# EAGLE design Akıllı_Lamba (EAGLE 9.6.2)
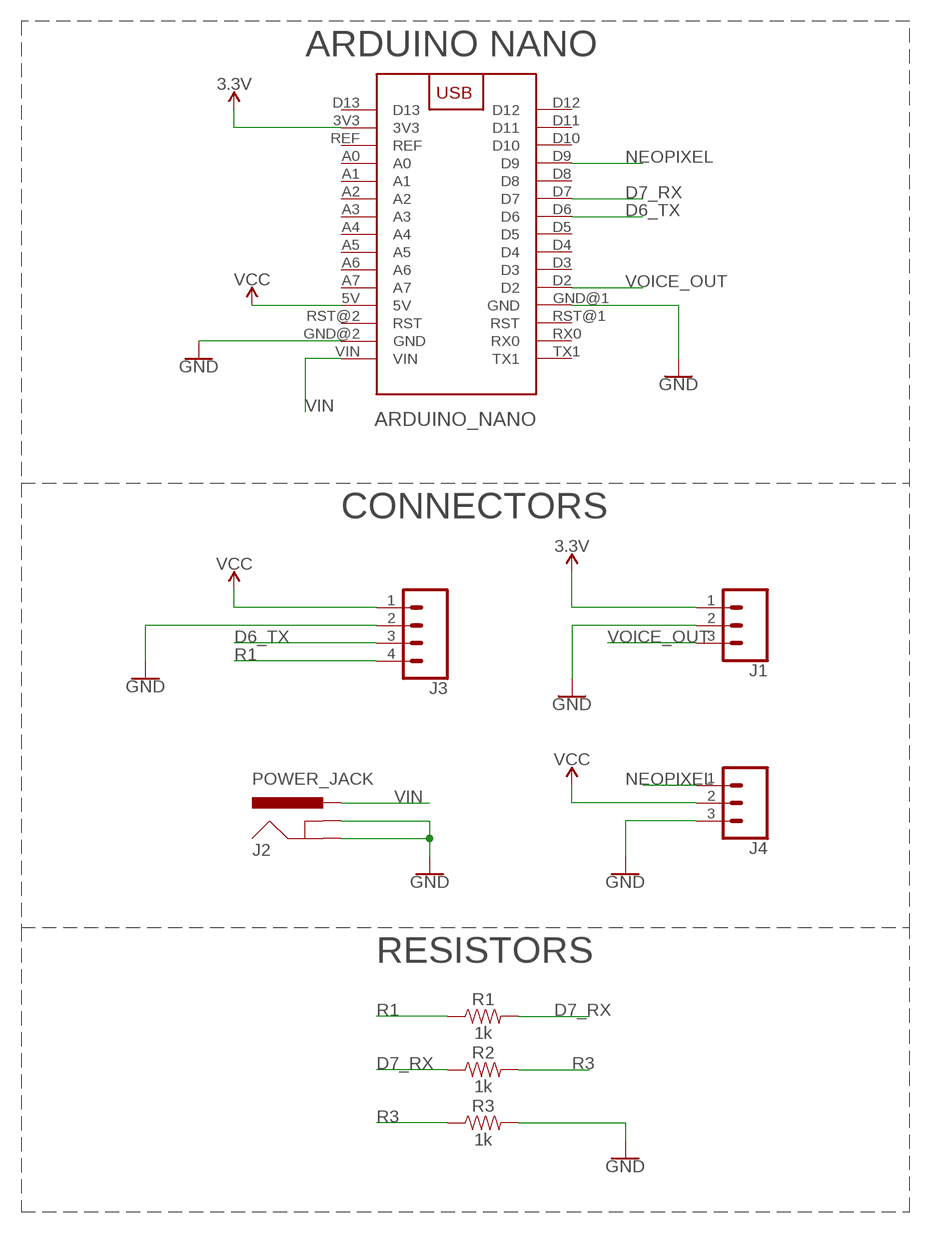
[diagram p0: schematic, sheet 1]

## Parts
ARDUINO_NANO  ARDUINONANO  [ARDUINONANO]
J1  455-1750-1-ND  CONN_03  [1X03]
J2  POWER_JACK  [POWER_JACK_PTH]
J3  CONN_04PTH  [1X04]
J4  455-1750-1-ND  CONN_03  [1X03]
R1  1k  1KOHM-HORIZ-1/4W-5%  [AXIAL-0.3]
R2  1k  1KOHM-HORIZ-1/4W-5%  [AXIAL-0.3]
R3  1k  1KOHM-HORIZ-1/4W-5%  [AXIAL-0.3]

## Nets
3.3V: ARDUINO_NANO.3V3 J1.1
D6_TX: ARDUINO_NANO.D6 J3.3
D7_RX: ARDUINO_NANO.D7 R1.P$2 R2.P$1
GND: ARDUINO_NANO.GND@1(GND) ARDUINO_NANO.GND@2(GND) J1.2 J2.GND J2.GNDBREAK J3.2 J4.3 R3.P$2
NEOPIXEL: ARDUINO_NANO.D9 J4.1
R1: J3.4 R1.P$1
R3: R2.P$2 R3.P$1
VCC: ARDUINO_NANO.5V J3.1 J4.2
VIN: ARDUINO_NANO.VIN J2.PWR
VOICE_OUT: ARDUINO_NANO.D2 J1.3
Unconnected: ARDUINO_NANO.A0 ARDUINO_NANO.A1 ARDUINO_NANO.A2 ARDUINO_NANO.A3 ARDUINO_NANO.A4 ARDUINO_NANO.A5 ARDUINO_NANO.A6 ARDUINO_NANO.A7 ARDUINO_NANO.D3 ARDUINO_NANO.D4 ARDUINO_NANO.D5 ARDUINO_NANO.D8 ARDUINO_NANO.D10 ARDUINO_NANO.D11 ARDUINO_NANO.D12 ARDUINO_NANO.D13 ARDUINO_NANO.REF ARDUINO_NANO.RST@1(RST) ARDUINO_NANO.RST@2(RST) ARDUINO_NANO.RX0 ARDUINO_NANO.TX1

## Notes on the sheet
- ARDUINO NANO
- CONNECTORS
- RESISTORS

## Library data of the parts
ARDUINO_NANO = ARDUINONANOSYMBOL:ARDUINONANO: ARDUINO NANO device
J1 J4 = SparkFun-Connectors:CONN_03: Multi connection point. Often used as Generic Header-pin footprint for 0.1 inch spaced/style header connections On any of the 0.1 inch spaced packages, you can populate with these: Break Away Headers - Straight <https://www.sparkfun.com/products/116> (PRT-00116) Break Away Male Headers - Right Angle <https://www.sparkfun.com/products/553> (PRT-00553) Female Headers <https://www.sparkfun.com/products/115> (PRT-00115) Break Away Headers - Machine Pin <https://www.sparkfun.com/products/117> (PRT-00117) Break Away Female Headers - Swiss Machine Pin <https://www.sparkfun.com/products/743> (PRT-00743) Stackable Header - 3 Pin (Female, 0.1") <https://www.sparkfun.com/products/13875> (PRT-13875) For SCREWTERMINALS and SPRING TERMINALS visit here: Screw Terimnals on SparkFun.com <https://www.sparkfun.com/search/results?term=Screw+Terminals> (5mm/3.5mm/2.54mm spacing) This device is also useful as a general connection point to wire up your design to another part of your project. Our various solder wires solder well into these plated through hole pads. Hook-Up Wire - Assortment (Stranded, 22 AWG) <https://www.sparkfun.com/products/11375> (PRT-11375) Hook-Up Wire - Assortment (Solid Core, 22 AWG) <https://www.sparkfun.com/products/11367> (PRT-11367) View the entire wire category on our website here <https://www.sparkfun.com/categories/141> Special notes: Molex polarized connector foot print use with SKU : PRT-08232 with associated crimp pins and housings.; PROD_ID: XXX-00000
J2 = SparkFun-Connectors:POWER_JACK: Power Jack Connector This is the standard 5.5mm barrel jack for power. The PTH is the most common, proven, reliable, footprint. The Slot footprint only works if the mill layer is transmitted to the PCB fab house so be warned. Here are the connectors we sell at SparkFun: DC Barrel Power Jack/Connector <https://www.sparkfun.com/products/119> (PRT-00119) DC Barrel Power Jack/Connector (SMD) <https://www.sparkfun.com/products/12748> (PRT-12748) DC Barrel Jack Adapter - Breadboard Compatible <https://www.sparkfun.com/products/10811> (PRT-10811) It is used on this SparkFun product (and many, many others): SparkFun RedBoard - Programmed with Arduino <https://www.sparkfun.com/products/12757> (DEV-12757) Also, if you need a mating power supply or connector, please check these out: Wall Adapter Power Supply - 9VDC 650mA <https://www.sparkfun.com/products/298> (TOL-00298) DC Barrel Jack Adapter - Male <https://www.sparkfun.com/products/10287> (PRT-10287); PROD_ID: CONN-08197
J3 = SparkFun-Connectors:CONN_04: Multi connection point. Often used as Generic Header-pin footprint for 0.1 inch spaced/style header connections On any of the 0.1 inch spaced packages, you can populate with these: Break Away Headers - Straight <https://www.sparkfun.com/products/116> (PRT-00116) Break Away Male Headers - Right Angle <https://www.sparkfun.com/products/553> (PRT-00553) Female Headers <https://www.sparkfun.com/products/115> (PRT-00115) Break Away Headers - Machine Pin <https://www.sparkfun.com/products/117> (PRT-00117) Break Away Female Headers - Swiss Machine Pin <https://www.sparkfun.com/products/743> (PRT-00743) For SCREWTERMINALS and SPRING TERMINALS visit here: Screw Terimnals on SparkFun.com <https://www.sparkfun.com/search/results?term=Screw+Terminals> (5mm/3.5mm/2.54mm spacing) This device is also useful as a general connection point to wire up your design to another part of your project. Our various solder wires solder well into these plated through hole pads. Hook-Up Wire - Assortment (Stranded, 22 AWG) <https://www.sparkfun.com/products/11375> (PRT-11375) Hook-Up Wire - Assortment (Solid Core, 22 AWG) <https://www.sparkfun.com/products/11367> (PRT-11367) View the entire wire category on our website here <https://www.sparkfun.com/categories/141> Special notes: Molex polarized connector foot print use with SKU : PRT-08231 with associated crimp pins and housings. 1MM SMD Version SKU: PRT-10208; PROD_ID: CONN-09696
R1-R3 = SparkFun-Resistors:1KOHM: 1kΩ resistor A resistor is a passive two-terminal electrical component that implements electrical resistance as a circuit element. Resistors act to reduce current flow, and, at the same time, act to lower voltage levels within circuits. - Wikipedia; PROD_ID: RES-08380

## Board
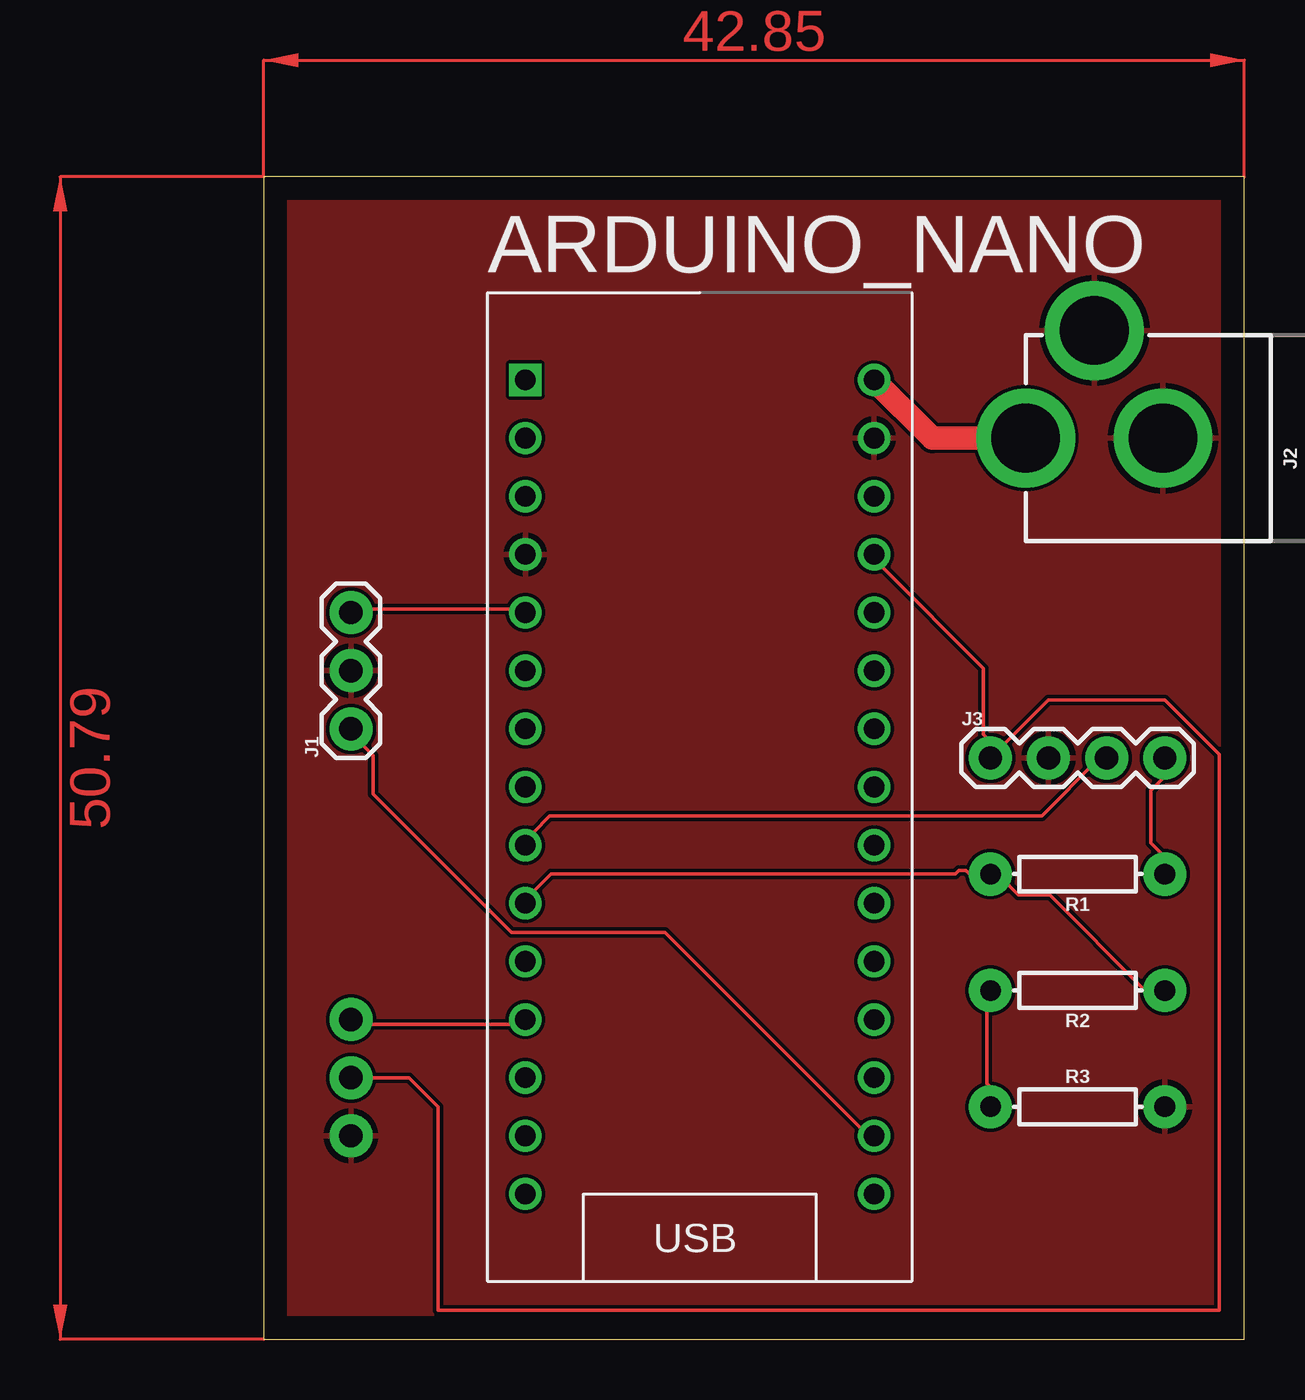
[diagram p1: board, top side]
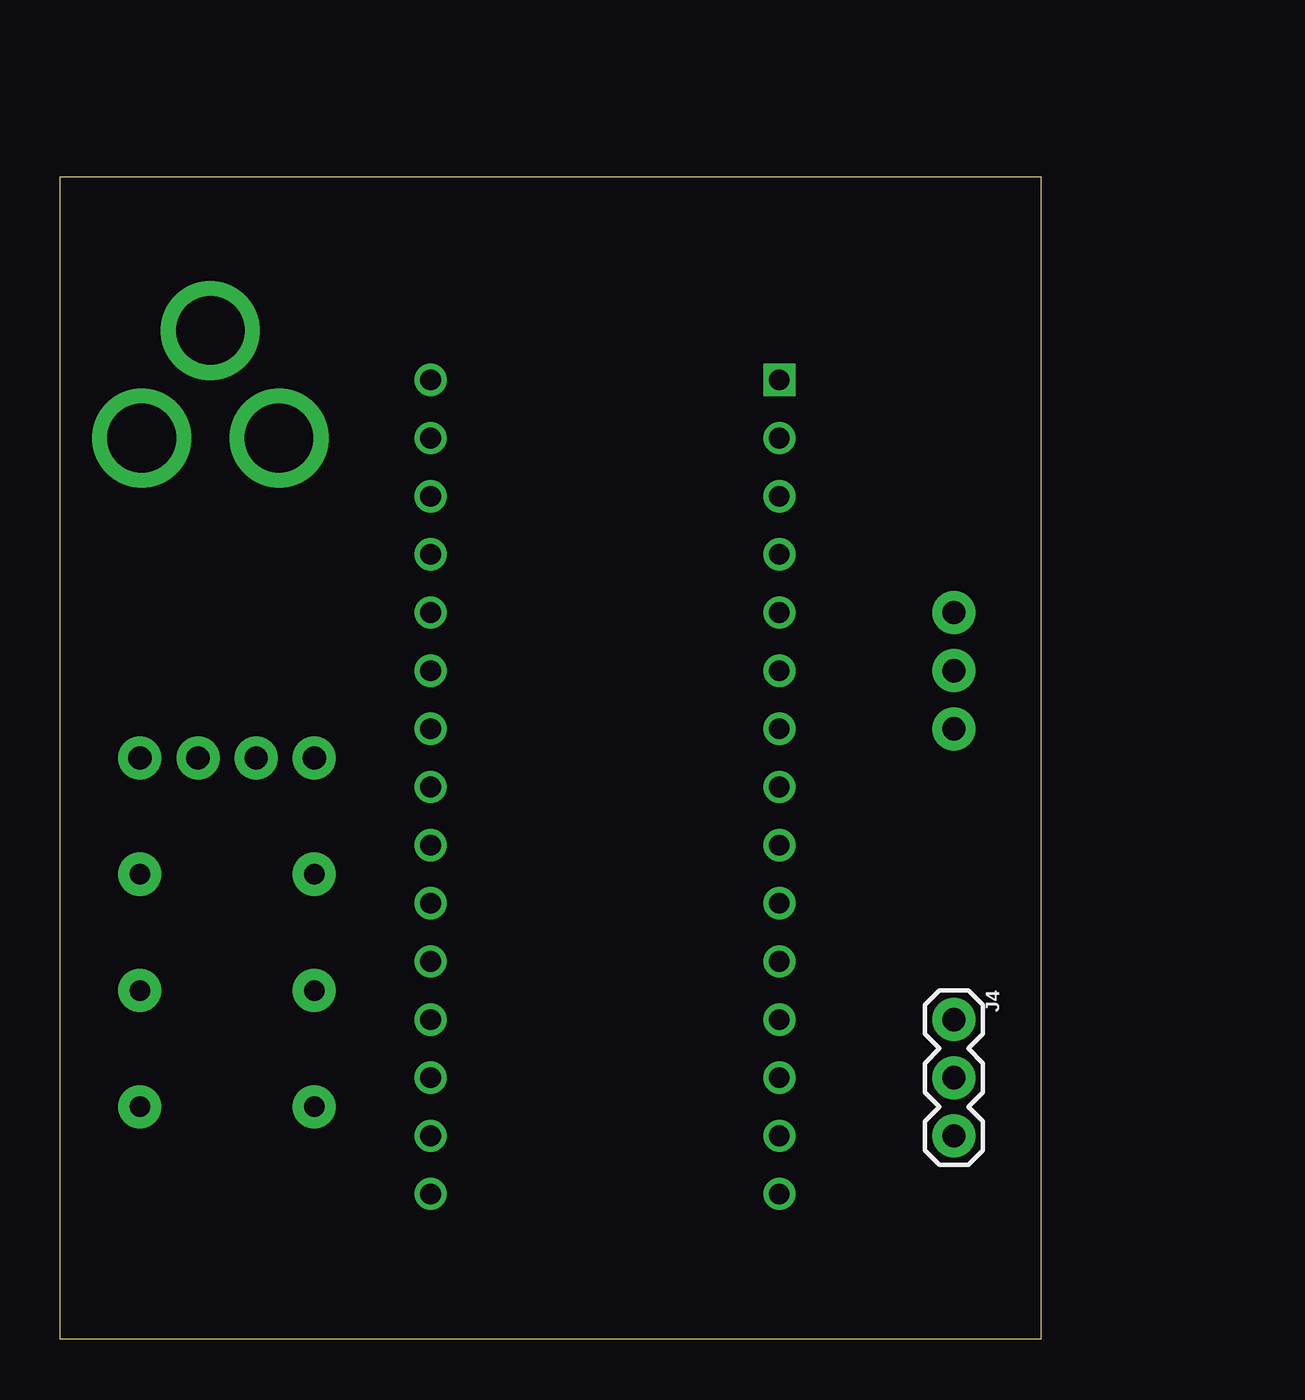
[diagram p2: board, bottom side, seen from below]

Size 42.85 x 50.79 mm. Coordinates in mm from the lower left corner, seen from the top.
Outline: 0,0 42.85,0 42.85,50.79 0,50.79 0,0
Copper layers (1*16): Top 0.035mm / dielectric 1.5mm / Bottom 0.035mm
Design rules "default": minimum track width 6mil, minimum drill 0.35mm, track to track 6mil, track to pad 6mil, pad to pad 6mil, via to via 6mil, smd to smd 6mil, copper to edge 40mil, drill to drill 6mil, minimum pad ring 10mil, minimum via ring 8mil, stop-mask expansion 4mil, vias tented up to drill 0mil, thermal gap 10mil

### Footprints (pad centres in the part's own frame; a part is rotated, then mirrored left to right if it is on the bottom)
ARDUINONANO = drill 0.9: 3V3 7.62,-15.24; 5V 7.62,10.16; A0 7.62,-10.16; A1 7.62,-7.62; A2 7.62,-5.08; A3 7.62,-2.54; A4 7.62,0; A5 7.62,2.54; A6 7.62,5.08; A7 7.62,7.62; D2 -7.62,7.62; D3 -7.62,5.08; D4 -7.62,2.54; D5 -7.62,0; D6 -7.62,-2.54; D7 -7.62,-5.08; D8 -7.62,-7.62; D9 -7.62,-10.16; D10 -7.62,-12.7; D11 -7.62,-15.24; D12 -7.62,-17.78; D13 7.62,-17.78; GND@1 -7.62,10.16; GND@2 7.62,15.24; REF 7.62,-12.7; RST@1 -7.62,12.7; RST@2 7.62,12.7; RX0 -7.62,15.24; VIN 7.62,17.78 | drill 0.9 square: TX1 -7.62,17.78
1X03 = drill 1.016 pad 1.88: 1 0,0; 2 2.54,0; 3 5.08,0
POWER_JACK_PTH = drill 2.997 pad 4.318: GND 0,7.7; GNDBREAK 4.7,10.7; PWR 0,13.7
1X04 = drill 1.016 pad 1.88: 1 0,0; 2 2.54,0; 3 5.08,0; 4 7.62,0
AXIAL-0.3 = drill 0.9 pad 1.88: P$1 -3.81,0; P$2 3.81,0

### Placement (x,y rotation side)
ARDUINO_NANO  19.05,24.13 0 top
J1  3.81,26.67 90 top
J2  46.99,39.37 90 top
J3  31.75,25.4 0 top
J4  3.81,13.97 270 bottom
R1  35.56,20.32 180 top
R2  35.56,15.24 180 top
R3  35.56,10.16 0 top

### Tracks (layer width: path | path; a pad name or v marks a point on that pad's centre or on a via)
3.3V
  Top 0.152: ARDUINO_NANO.3V3 26.57,8.89 26.26,9.19 26.11,9.19 17.53,17.78 10.82,17.78 4.77,23.83 4.77,25.5 3.71,26.57 J1.1
D6_TX
  Top 0.152: ARDUINO_NANO.D6 11.48,21.69 11.79,22 11.79,22.15 12.5,22.86 33.99,22.86 36.47,25.35 36.78,25.35 J3.3
D7_RX
  Top 0.152: ARDUINO_NANO.D7 11.79,19.41 11.79,19.56 12.55,20.32 30.23,20.32 30.38,20.47 30.68,20.47 30.84,20.32 R1.P$2 32.06,20.32 32.97,19.41 34.34,19.41 38.46,15.29 39.37,15.29 R2.P$1
GND
  pour Top: -3.81,53.34 46.99,53.34 46.99,-2.54 -3.81,-2.54
NEOPIXEL
  Top 0.152: J4.1 4.01,13.77 10.72,13.77 10.87,13.92 11.33,13.92 ARDUINO_NANO.D9
R1
  Top 0.152: R1.P$1 39.37,21.08 38.76,21.69 38.76,23.98 39.37,24.59 J3.4
R3
  Top 0.152: R3.P$1 31.75,11.02 31.6,11.18 31.6,14.99 31.75,15.14 R2.P$2
VCC
  Top 0.152: J4.2 6.35,11.43 7.62,10.16 7.62,1.27 41.76,1.27 41.76,25.55 39.37,27.94 34.29,27.94 J3.1 31.75,26.11 31.45,26.42 31.45,29.31 27.03,33.73 27.03,33.88 26.72,34.19 26.72,34.24 ARDUINO_NANO.5V
VIN
  Top 1.016: J2.PWR 29.21,39.37 ARDUINO_NANO.VIN
VOICE_OUT
  Top 0.152: ARDUINO_NANO.D2 10.87,31.75 10.72,31.9 4.01,31.9 3.86,31.75 J1.3
(copper drawn outside any net)
  shapes: Top area x2